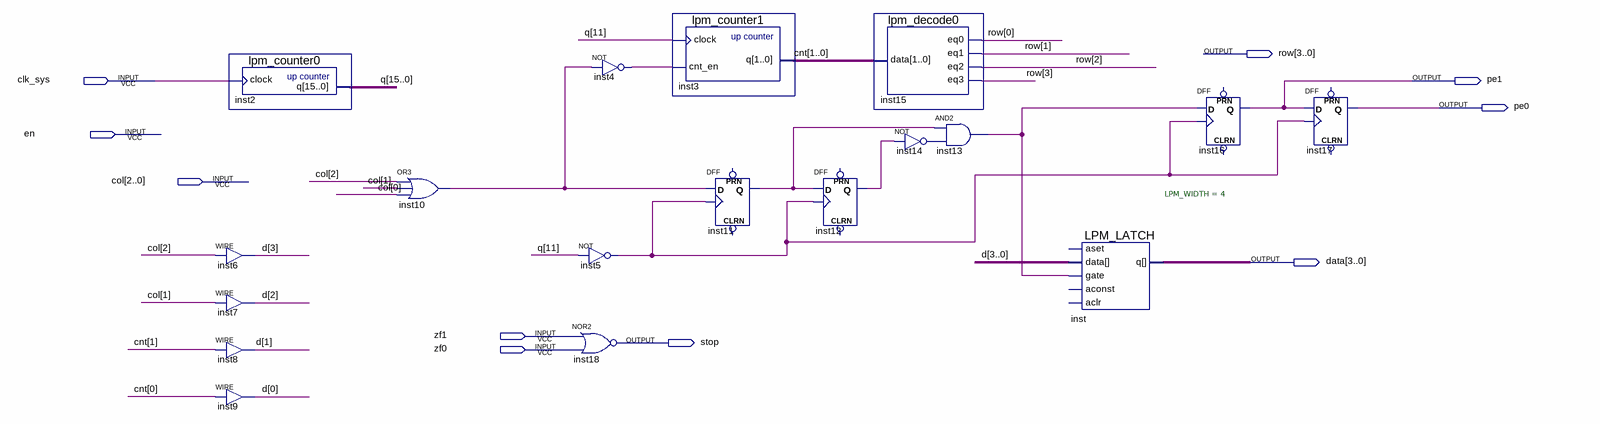
[diagram p0: schematic sheet]
// Quartus schematic Key.bdf as structural Verilog: 18 symbols, 10 pins
module Key (
  input  clk_sys,
  input  en,
  input  [2:0] col,
  input  zf1,
  input  zf0,
  output [3:0] row,
  output pe1,
  output pe0,
  output [3:0] data,
  output stop
);

  wire inst4_out, inst5_out, inst10_out, inst11_q, inst12_q, inst13_out, inst14_out;
  wire [1:0] cnt;
  wire [3:0] d;
  wire [15:0] q;

  lpm_counter0 inst2 (.clock(clk_sys), .q(q));
  assign d[3] = col[2];  // WIRE inst6
  assign d[2] = col[1];  // WIRE inst7
  assign d[1] = cnt[1];  // WIRE inst8
  assign d[0] = cnt[0];  // WIRE inst9
  or inst10 (inst10_out, col[2], col[1], col[0]);
  nor inst18 (stop, zf1, zf0);
  not inst4 (inst4_out, inst10_out);
  not inst5 (inst5_out, q[11]);
  lpm_counter1 inst3 (.clock(q[11]), .cnt_en(inst4_out), .q(cnt));
  DFF inst11 (.CLK(inst5_out), .D(inst10_out), .Q(inst11_q));  // open: CLRN, PRN
  DFF inst12 (.CLK(inst5_out), .D(inst11_q), .Q(inst12_q));  // open: CLRN, PRN
  lpm_decode0 inst15 (.data(cnt), .eq0(row[0]), .eq1(row[1]), .eq2(row[2]), .eq3(row[3]));
  not inst14 (inst14_out, inst12_q);
  and inst13 (inst13_out, inst11_q, inst14_out);
  LPM_LATCH #(.LPM_WIDTH(4)) inst (.data(d), .gate(inst13_out), .q(data));  // open: aset, aconst, aclr
  DFF inst16 (.CLK(inst5_out), .D(inst13_out), .Q(pe1));  // open: CLRN, PRN
  DFF inst17 (.CLK(inst5_out), .D(pe1), .Q(pe0));  // open: CLRN, PRN
endmodule
